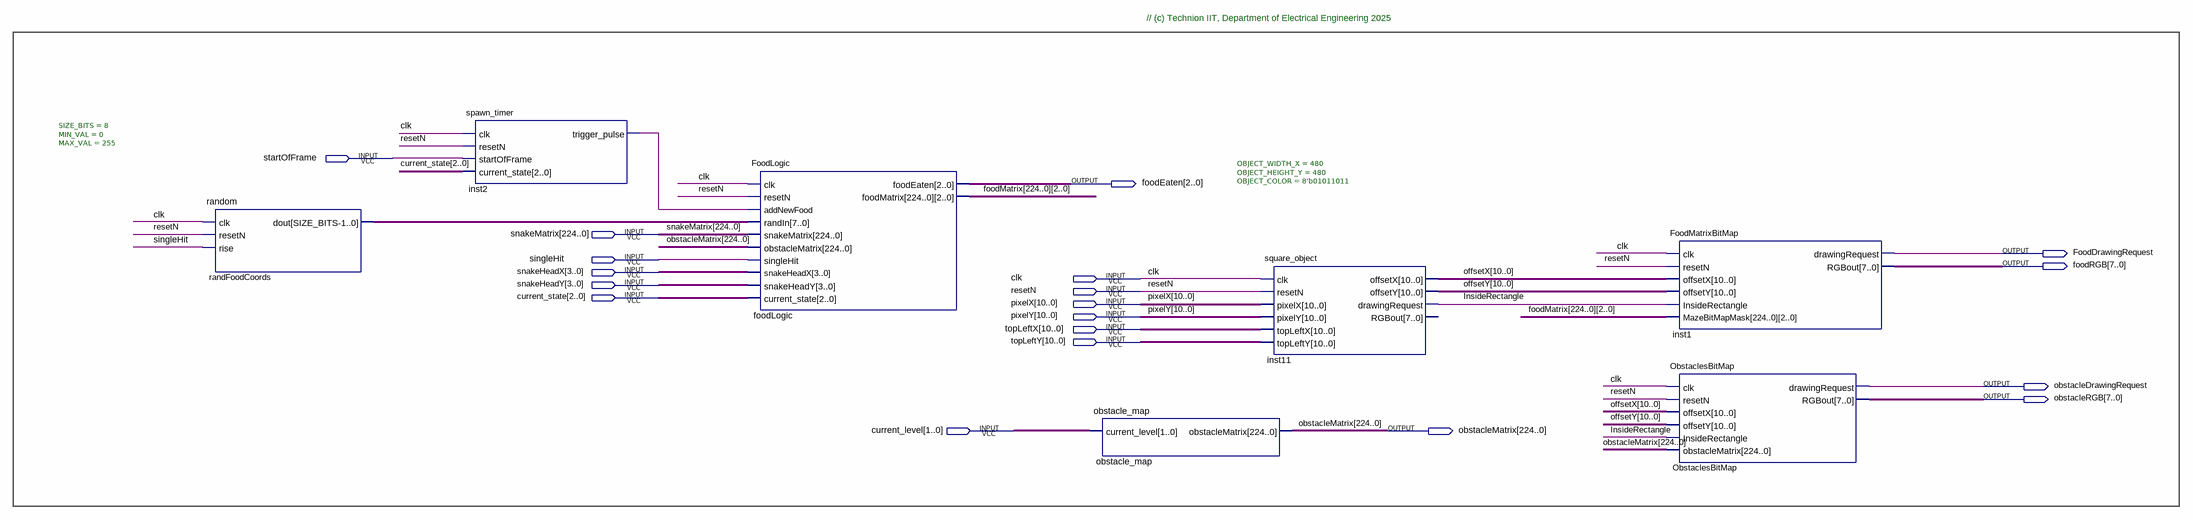
[diagram p0: schematic sheet]
// Quartus schematic Food_Obstacle_Display.bdf as structural Verilog: 7 symbols, 19 pins
module Food_Obstacle_Display (
  input  startOfFrame,
  input  [224:0] snakeMatrix,
  input  singleHit,
  input  [3:0] snakeHeadX,
  input  clk,
  input  [3:0] snakeHeadY,
  input  resetN,
  input  [2:0] current_state,
  input  [10:0] pixelX,
  input  [10:0] pixelY,
  input  [10:0] topLeftX,
  input  [10:0] topLeftY,
  input  [1:0] current_level,
  output [2:0] foodEaten,
  output FoodDrawingRequest,
  output [7:0] foodRGB,
  output obstacleDrawingRequest,
  output [7:0] obstacleRGB,
  output [224:0] obstacleMatrix
);

  wire InsideRectangle, inst2_trigger_pulse;
  wire [2:0] foodMatrix_0, foodMatrix_1, foodMatrix_2, foodMatrix_3, foodMatrix_4, foodMatrix_5,
       foodMatrix_6, foodMatrix_7, foodMatrix_8, foodMatrix_9, foodMatrix_10, foodMatrix_11, foodMatrix_12,
       foodMatrix_13, foodMatrix_14, foodMatrix_15, foodMatrix_16, foodMatrix_17, foodMatrix_18,
       foodMatrix_19, foodMatrix_20, foodMatrix_21, foodMatrix_22, foodMatrix_23, foodMatrix_24,
       foodMatrix_25, foodMatrix_26, foodMatrix_27, foodMatrix_28, foodMatrix_29, foodMatrix_30,
       foodMatrix_31, foodMatrix_32, foodMatrix_33, foodMatrix_34, foodMatrix_35, foodMatrix_36,
       foodMatrix_37, foodMatrix_38, foodMatrix_39, foodMatrix_40, foodMatrix_41, foodMatrix_42,
       foodMatrix_43, foodMatrix_44, foodMatrix_45, foodMatrix_46, foodMatrix_47, foodMatrix_48,
       foodMatrix_49, foodMatrix_50, foodMatrix_51, foodMatrix_52, foodMatrix_53, foodMatrix_54,
       foodMatrix_55, foodMatrix_56, foodMatrix_57, foodMatrix_58, foodMatrix_59, foodMatrix_60,
       foodMatrix_61, foodMatrix_62, foodMatrix_63, foodMatrix_64, foodMatrix_65, foodMatrix_66,
       foodMatrix_67, foodMatrix_68, foodMatrix_69, foodMatrix_70, foodMatrix_71, foodMatrix_72,
       foodMatrix_73, foodMatrix_74, foodMatrix_75, foodMatrix_76, foodMatrix_77, foodMatrix_78,
       foodMatrix_79, foodMatrix_80, foodMatrix_81, foodMatrix_82, foodMatrix_83, foodMatrix_84,
       foodMatrix_85, foodMatrix_86, foodMatrix_87, foodMatrix_88, foodMatrix_89, foodMatrix_90,
       foodMatrix_91, foodMatrix_92, foodMatrix_93, foodMatrix_94, foodMatrix_95, foodMatrix_96,
       foodMatrix_97, foodMatrix_98, foodMatrix_99, foodMatrix_100, foodMatrix_101, foodMatrix_102,
       foodMatrix_103, foodMatrix_104, foodMatrix_105, foodMatrix_106, foodMatrix_107, foodMatrix_108,
       foodMatrix_109, foodMatrix_110, foodMatrix_111, foodMatrix_112, foodMatrix_113, foodMatrix_114,
       foodMatrix_115, foodMatrix_116, foodMatrix_117, foodMatrix_118, foodMatrix_119, foodMatrix_120,
       foodMatrix_121, foodMatrix_122, foodMatrix_123, foodMatrix_124, foodMatrix_125, foodMatrix_126,
       foodMatrix_127, foodMatrix_128, foodMatrix_129, foodMatrix_130, foodMatrix_131, foodMatrix_132,
       foodMatrix_133, foodMatrix_134, foodMatrix_135, foodMatrix_136, foodMatrix_137, foodMatrix_138,
       foodMatrix_139, foodMatrix_140, foodMatrix_141, foodMatrix_142, foodMatrix_143, foodMatrix_144,
       foodMatrix_145, foodMatrix_146, foodMatrix_147, foodMatrix_148, foodMatrix_149, foodMatrix_150,
       foodMatrix_151, foodMatrix_152, foodMatrix_153, foodMatrix_154, foodMatrix_155, foodMatrix_156,
       foodMatrix_157, foodMatrix_158, foodMatrix_159, foodMatrix_160, foodMatrix_161, foodMatrix_162,
       foodMatrix_163, foodMatrix_164, foodMatrix_165, foodMatrix_166, foodMatrix_167, foodMatrix_168,
       foodMatrix_169, foodMatrix_170, foodMatrix_171, foodMatrix_172, foodMatrix_173, foodMatrix_174,
       foodMatrix_175, foodMatrix_176, foodMatrix_177, foodMatrix_178, foodMatrix_179, foodMatrix_180,
       foodMatrix_181, foodMatrix_182, foodMatrix_183, foodMatrix_184, foodMatrix_185, foodMatrix_186,
       foodMatrix_187, foodMatrix_188, foodMatrix_189, foodMatrix_190, foodMatrix_191, foodMatrix_192,
       foodMatrix_193, foodMatrix_194, foodMatrix_195, foodMatrix_196, foodMatrix_197, foodMatrix_198,
       foodMatrix_199, foodMatrix_200, foodMatrix_201, foodMatrix_202, foodMatrix_203, foodMatrix_204,
       foodMatrix_205, foodMatrix_206, foodMatrix_207, foodMatrix_208, foodMatrix_209, foodMatrix_210,
       foodMatrix_211, foodMatrix_212, foodMatrix_213, foodMatrix_214, foodMatrix_215, foodMatrix_216,
       foodMatrix_217, foodMatrix_218, foodMatrix_219, foodMatrix_220, foodMatrix_221, foodMatrix_222,
       foodMatrix_223, foodMatrix_224;
  wire [7:0] randFoodCoords_dout;
  wire [10:0] offsetX, offsetY;

  random #(.SIZE_BITS(8), .MIN_VAL(0), .MAX_VAL(255)) randFoodCoords (
    .clk(clk), .resetN(resetN), .rise(singleHit), .dout(randFoodCoords_dout));
  spawn_timer inst2 (
    .clk(clk), .resetN(resetN), .startOfFrame(startOfFrame), .current_state(current_state),
    .trigger_pulse(inst2_trigger_pulse));
  FoodLogic foodLogic (
    .clk(clk), .resetN(resetN), .addNewFood(inst2_trigger_pulse), .randIn(randFoodCoords_dout),
    .snakeMatrix(snakeMatrix), .obstacleMatrix(obstacleMatrix), .singleHit(singleHit),
    .snakeHeadX(snakeHeadX), .snakeHeadY(snakeHeadY), .current_state(current_state), .foodEaten(foodEaten),
    .foodMatrix({foodMatrix_224, foodMatrix_223, foodMatrix_222, foodMatrix_221, foodMatrix_220, foodMatrix_219, foodMatrix_218, foodMatrix_217, foodMatrix_216, foodMatrix_215, foodMatrix_214, foodMatrix_213, foodMatrix_212, foodMatrix_211, foodMatrix_210, foodMatrix_209, foodMatrix_208, foodMatrix_207, foodMatrix_206, foodMatrix_205, foodMatrix_204, foodMatrix_203, foodMatrix_202, foodMatrix_201, foodMatrix_200, foodMatrix_199, foodMatrix_198, foodMatrix_197, foodMatrix_196, foodMatrix_195, foodMatrix_194, foodMatrix_193, foodMatrix_192, foodMatrix_191, foodMatrix_190, foodMatrix_189, foodMatrix_188, foodMatrix_187, foodMatrix_186, foodMatrix_185, foodMatrix_184, foodMatrix_183, foodMatrix_182, foodMatrix_181, foodMatrix_180, foodMatrix_179, foodMatrix_178, foodMatrix_177, foodMatrix_176, foodMatrix_175, foodMatrix_174, foodMatrix_173, foodMatrix_172, foodMatrix_171, foodMatrix_170, foodMatrix_169, foodMatrix_168, foodMatrix_167, foodMatrix_166, foodMatrix_165, foodMatrix_164, foodMatrix_163, foodMatrix_162, foodMatrix_161, foodMatrix_160, foodMatrix_159, foodMatrix_158, foodMatrix_157, foodMatrix_156, foodMatrix_155, foodMatrix_154, foodMatrix_153, foodMatrix_152, foodMatrix_151, foodMatrix_150, foodMatrix_149, foodMatrix_148, foodMatrix_147, foodMatrix_146, foodMatrix_145, foodMatrix_144, foodMatrix_143, foodMatrix_142, foodMatrix_141, foodMatrix_140, foodMatrix_139, foodMatrix_138, foodMatrix_137, foodMatrix_136, foodMatrix_135, foodMatrix_134, foodMatrix_133, foodMatrix_132, foodMatrix_131, foodMatrix_130, foodMatrix_129, foodMatrix_128, foodMatrix_127, foodMatrix_126, foodMatrix_125, foodMatrix_124, foodMatrix_123, foodMatrix_122, foodMatrix_121, foodMatrix_120, foodMatrix_119, foodMatrix_118, foodMatrix_117, foodMatrix_116, foodMatrix_115, foodMatrix_114, foodMatrix_113, foodMatrix_112, foodMatrix_111, foodMatrix_110, foodMatrix_109, foodMatrix_108, foodMatrix_107, foodMatrix_106, foodMatrix_105, foodMatrix_104, foodMatrix_103, foodMatrix_102, foodMatrix_101, foodMatrix_100, foodMatrix_99, foodMatrix_98, foodMatrix_97, foodMatrix_96, foodMatrix_95, foodMatrix_94, foodMatrix_93, foodMatrix_92, foodMatrix_91, foodMatrix_90, foodMatrix_89, foodMatrix_88, foodMatrix_87, foodMatrix_86, foodMatrix_85, foodMatrix_84, foodMatrix_83, foodMatrix_82, foodMatrix_81, foodMatrix_80, foodMatrix_79, foodMatrix_78, foodMatrix_77, foodMatrix_76, foodMatrix_75, foodMatrix_74, foodMatrix_73, foodMatrix_72, foodMatrix_71, foodMatrix_70, foodMatrix_69, foodMatrix_68, foodMatrix_67, foodMatrix_66, foodMatrix_65, foodMatrix_64, foodMatrix_63, foodMatrix_62, foodMatrix_61, foodMatrix_60, foodMatrix_59, foodMatrix_58, foodMatrix_57, foodMatrix_56, foodMatrix_55, foodMatrix_54, foodMatrix_53, foodMatrix_52, foodMatrix_51, foodMatrix_50, foodMatrix_49, foodMatrix_48, foodMatrix_47, foodMatrix_46, foodMatrix_45, foodMatrix_44, foodMatrix_43, foodMatrix_42, foodMatrix_41, foodMatrix_40, foodMatrix_39, foodMatrix_38, foodMatrix_37, foodMatrix_36, foodMatrix_35, foodMatrix_34, foodMatrix_33, foodMatrix_32, foodMatrix_31, foodMatrix_30, foodMatrix_29, foodMatrix_28, foodMatrix_27, foodMatrix_26, foodMatrix_25, foodMatrix_24, foodMatrix_23, foodMatrix_22, foodMatrix_21, foodMatrix_20, foodMatrix_19, foodMatrix_18, foodMatrix_17, foodMatrix_16, foodMatrix_15, foodMatrix_14, foodMatrix_13, foodMatrix_12, foodMatrix_11, foodMatrix_10, foodMatrix_9, foodMatrix_8, foodMatrix_7, foodMatrix_6, foodMatrix_5, foodMatrix_4, foodMatrix_3, foodMatrix_2, foodMatrix_1, foodMatrix_0}));
  obstacle_map obstacle_map (.current_level(current_level), .obstacleMatrix(obstacleMatrix));
  square_object #(.OBJECT_WIDTH_X(480), .OBJECT_HEIGHT_Y(480), .OBJECT_COLOR(8'b01011011)) inst11 (
    .clk(clk), .resetN(resetN), .pixelX(pixelX), .pixelY(pixelY), .topLeftX(topLeftX), .topLeftY(topLeftY),
    .offsetX(offsetX), .offsetY(offsetY), .drawingRequest(InsideRectangle));  // open: RGBout
  FoodMatrixBitMap inst1 (
    .clk(clk), .resetN(resetN), .offsetX(offsetX), .offsetY(offsetY), .InsideRectangle(InsideRectangle),
    .MazeBitMapMask({foodMatrix_224, foodMatrix_223, foodMatrix_222, foodMatrix_221, foodMatrix_220, foodMatrix_219, foodMatrix_218, foodMatrix_217, foodMatrix_216, foodMatrix_215, foodMatrix_214, foodMatrix_213, foodMatrix_212, foodMatrix_211, foodMatrix_210, foodMatrix_209, foodMatrix_208, foodMatrix_207, foodMatrix_206, foodMatrix_205, foodMatrix_204, foodMatrix_203, foodMatrix_202, foodMatrix_201, foodMatrix_200, foodMatrix_199, foodMatrix_198, foodMatrix_197, foodMatrix_196, foodMatrix_195, foodMatrix_194, foodMatrix_193, foodMatrix_192, foodMatrix_191, foodMatrix_190, foodMatrix_189, foodMatrix_188, foodMatrix_187, foodMatrix_186, foodMatrix_185, foodMatrix_184, foodMatrix_183, foodMatrix_182, foodMatrix_181, foodMatrix_180, foodMatrix_179, foodMatrix_178, foodMatrix_177, foodMatrix_176, foodMatrix_175, foodMatrix_174, foodMatrix_173, foodMatrix_172, foodMatrix_171, foodMatrix_170, foodMatrix_169, foodMatrix_168, foodMatrix_167, foodMatrix_166, foodMatrix_165, foodMatrix_164, foodMatrix_163, foodMatrix_162, foodMatrix_161, foodMatrix_160, foodMatrix_159, foodMatrix_158, foodMatrix_157, foodMatrix_156, foodMatrix_155, foodMatrix_154, foodMatrix_153, foodMatrix_152, foodMatrix_151, foodMatrix_150, foodMatrix_149, foodMatrix_148, foodMatrix_147, foodMatrix_146, foodMatrix_145, foodMatrix_144, foodMatrix_143, foodMatrix_142, foodMatrix_141, foodMatrix_140, foodMatrix_139, foodMatrix_138, foodMatrix_137, foodMatrix_136, foodMatrix_135, foodMatrix_134, foodMatrix_133, foodMatrix_132, foodMatrix_131, foodMatrix_130, foodMatrix_129, foodMatrix_128, foodMatrix_127, foodMatrix_126, foodMatrix_125, foodMatrix_124, foodMatrix_123, foodMatrix_122, foodMatrix_121, foodMatrix_120, foodMatrix_119, foodMatrix_118, foodMatrix_117, foodMatrix_116, foodMatrix_115, foodMatrix_114, foodMatrix_113, foodMatrix_112, foodMatrix_111, foodMatrix_110, foodMatrix_109, foodMatrix_108, foodMatrix_107, foodMatrix_106, foodMatrix_105, foodMatrix_104, foodMatrix_103, foodMatrix_102, foodMatrix_101, foodMatrix_100, foodMatrix_99, foodMatrix_98, foodMatrix_97, foodMatrix_96, foodMatrix_95, foodMatrix_94, foodMatrix_93, foodMatrix_92, foodMatrix_91, foodMatrix_90, foodMatrix_89, foodMatrix_88, foodMatrix_87, foodMatrix_86, foodMatrix_85, foodMatrix_84, foodMatrix_83, foodMatrix_82, foodMatrix_81, foodMatrix_80, foodMatrix_79, foodMatrix_78, foodMatrix_77, foodMatrix_76, foodMatrix_75, foodMatrix_74, foodMatrix_73, foodMatrix_72, foodMatrix_71, foodMatrix_70, foodMatrix_69, foodMatrix_68, foodMatrix_67, foodMatrix_66, foodMatrix_65, foodMatrix_64, foodMatrix_63, foodMatrix_62, foodMatrix_61, foodMatrix_60, foodMatrix_59, foodMatrix_58, foodMatrix_57, foodMatrix_56, foodMatrix_55, foodMatrix_54, foodMatrix_53, foodMatrix_52, foodMatrix_51, foodMatrix_50, foodMatrix_49, foodMatrix_48, foodMatrix_47, foodMatrix_46, foodMatrix_45, foodMatrix_44, foodMatrix_43, foodMatrix_42, foodMatrix_41, foodMatrix_40, foodMatrix_39, foodMatrix_38, foodMatrix_37, foodMatrix_36, foodMatrix_35, foodMatrix_34, foodMatrix_33, foodMatrix_32, foodMatrix_31, foodMatrix_30, foodMatrix_29, foodMatrix_28, foodMatrix_27, foodMatrix_26, foodMatrix_25, foodMatrix_24, foodMatrix_23, foodMatrix_22, foodMatrix_21, foodMatrix_20, foodMatrix_19, foodMatrix_18, foodMatrix_17, foodMatrix_16, foodMatrix_15, foodMatrix_14, foodMatrix_13, foodMatrix_12, foodMatrix_11, foodMatrix_10, foodMatrix_9, foodMatrix_8, foodMatrix_7, foodMatrix_6, foodMatrix_5, foodMatrix_4, foodMatrix_3, foodMatrix_2, foodMatrix_1, foodMatrix_0}),
    .drawingRequest(FoodDrawingRequest), .RGBout(foodRGB));
  ObstaclesBitMap ObstaclesBitMap (
    .clk(clk), .resetN(resetN), .offsetX(offsetX), .offsetY(offsetY), .InsideRectangle(InsideRectangle),
    .obstacleMatrix(obstacleMatrix), .drawingRequest(obstacleDrawingRequest), .RGBout(obstacleRGB));

  // Notes on the sheet:
  //   // (c) Technion IIT, Department of Electrical Engineering 2025
endmodule
